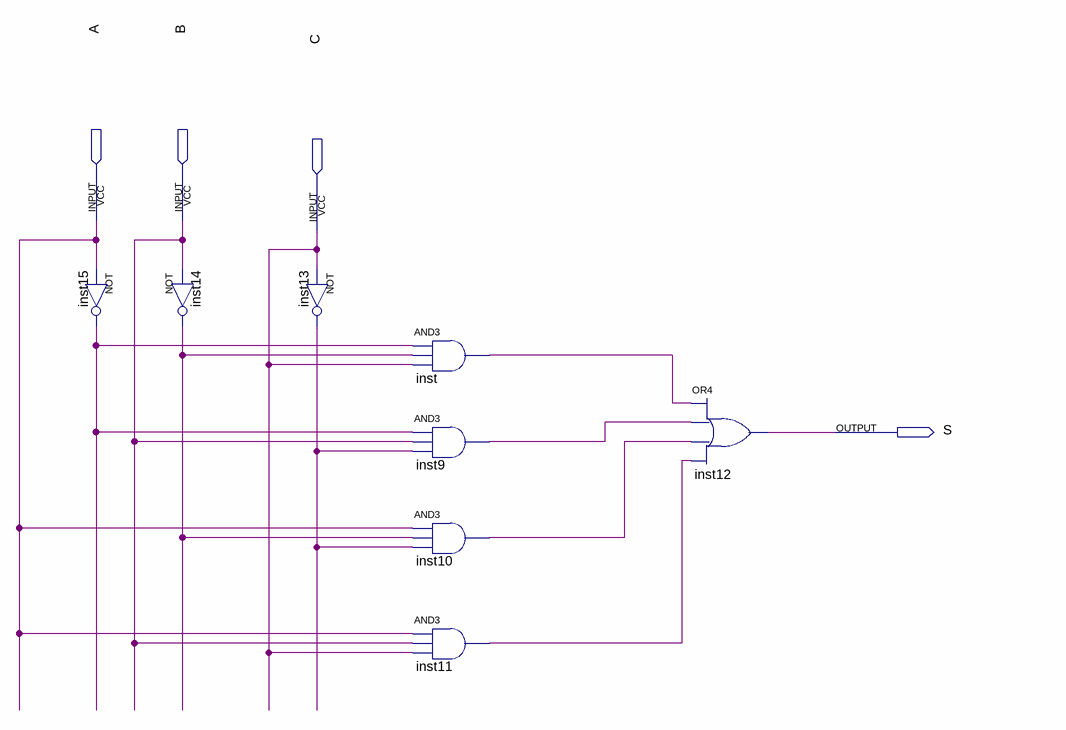
[diagram p0: schematic sheet]
// Quartus schematic exp1.bdf as structural Verilog: 8 symbols, 4 pins
module exp1 (
  input  A,
  input  B,
  input  C,
  output S
);

  wire inst9_out, inst10_out, inst11_out, inst13_out, inst14_out, inst15_out, inst_out;

  not inst15 (inst15_out, A);
  not inst14 (inst14_out, B);
  not inst13 (inst13_out, C);
  and inst (inst_out, inst15_out, inst14_out, C);
  and inst9 (inst9_out, inst15_out, B, inst13_out);
  and inst10 (inst10_out, A, inst14_out, inst13_out);
  and inst11 (inst11_out, A, B, C);
  or inst12 (S, inst_out, inst9_out, inst10_out, inst11_out);
endmodule
